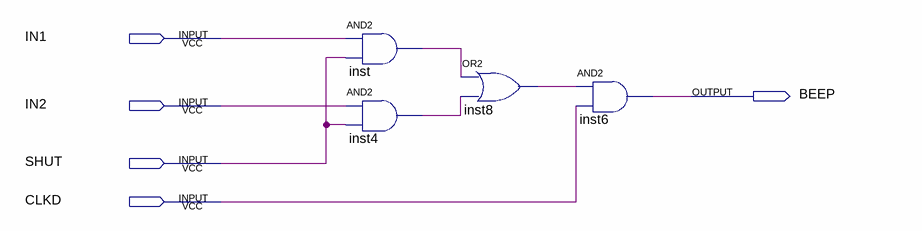
[diagram p0: schematic sheet]
// Quartus schematic AlarmControl.bdf as structural Verilog: 4 symbols, 5 pins
module AlarmControl (
  input  IN1,
  input  IN2,
  input  SHUT,
  input  CLKD,
  output BEEP
);

  wire inst4_out, inst8_out, inst_out;

  and inst (inst_out, IN1, SHUT);
  and inst4 (inst4_out, IN2, SHUT);
  or inst8 (inst8_out, inst_out, inst4_out);
  and inst6 (BEEP, inst8_out, CLKD);
endmodule
